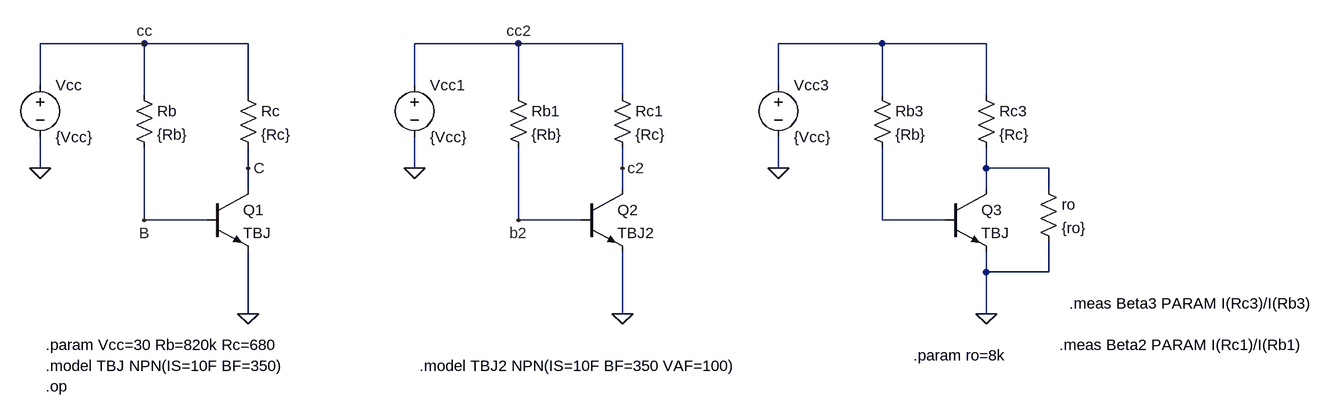
[diagram p0: schematic TBJ01Beta.asc]
TBJ01Beta.asc, the LTspice schematic file:
Version 4
SHEET 1 1960 928
WIRE 128 -16 -32 -16
WIRE 288 -16 128 -16
WIRE 704 -16 544 -16
WIRE 864 -16 704 -16
WIRE 1264 -16 1104 -16
WIRE 1424 -16 1264 -16
WIRE -32 48 -32 -16
WIRE 544 48 544 -16
WIRE 1104 48 1104 -16
WIRE 128 64 128 -16
WIRE 288 64 288 -16
WIRE 704 64 704 -16
WIRE 864 64 864 -16
WIRE 1264 64 1264 -16
WIRE 1424 64 1424 -16
WIRE -32 176 -32 128
WIRE 288 176 288 144
WIRE 544 176 544 128
WIRE 864 176 864 144
WIRE 1104 176 1104 128
WIRE 1424 176 1424 144
WIRE 1520 176 1424 176
WIRE 288 208 288 176
WIRE 864 208 864 176
WIRE 1424 208 1424 176
WIRE 1520 208 1520 176
WIRE 128 256 128 144
WIRE 224 256 128 256
WIRE 704 256 704 144
WIRE 800 256 704 256
WIRE 1264 256 1264 144
WIRE 1360 256 1264 256
WIRE 1424 336 1424 304
WIRE 1520 336 1520 288
WIRE 1520 336 1424 336
WIRE 288 400 288 304
WIRE 864 400 864 304
WIRE 1424 400 1424 336
FLAG -32 176 0
FLAG 288 400 0
FLAG 128 -16 cc
FLAG 128 256 B
FLAG 288 176 C
FLAG 544 176 0
FLAG 864 400 0
FLAG 704 -16 cc2
FLAG 704 256 b2
FLAG 864 176 c2
FLAG 1104 176 0
FLAG 1424 400 0
SYMBOL res 112 48 R0
SYMATTR InstName Rb
SYMATTR Value {Rb}
SYMBOL res 272 48 R0
SYMATTR InstName Rc
SYMATTR Value {Rc}
SYMBOL voltage -32 32 R0
WINDOW 123 0 0 Left 0
WINDOW 39 0 0 Left 0
SYMATTR InstName Vcc
SYMATTR Value {Vcc}
SYMBOL npn 224 208 R0
SYMATTR InstName Q1
SYMATTR Value TBJ
SYMBOL res 688 48 R0
SYMATTR InstName Rb1
SYMATTR Value {Rb}
SYMBOL res 848 48 R0
SYMATTR InstName Rc1
SYMATTR Value {Rc}
SYMBOL voltage 544 32 R0
WINDOW 123 0 0 Left 0
WINDOW 39 0 0 Left 0
SYMATTR InstName Vcc1
SYMATTR Value {Vcc}
SYMBOL npn 800 208 R0
SYMATTR InstName Q2
SYMATTR Value TBJ2
SYMBOL res 1248 48 R0
SYMATTR InstName Rb3
SYMATTR Value {Rb}
SYMBOL res 1408 48 R0
SYMATTR InstName Rc3
SYMATTR Value {Rc}
SYMBOL voltage 1104 32 R0
WINDOW 123 0 0 Left 0
WINDOW 39 0 0 Left 0
SYMATTR InstName Vcc3
SYMATTR Value {Vcc}
SYMBOL npn 1360 208 R0
SYMATTR InstName Q3
SYMATTR Value TBJ
SYMBOL res 1504 192 R0
SYMATTR InstName ro
SYMATTR Value {ro}
TEXT -24 448 Left 2 !.param Vcc=30 Rb=820k Rc=680
TEXT -24 512 Left 2 !.op
TEXT -24 480 Left 2 !.model TBJ NPN(IS=10F BF=350)
TEXT 552 480 Left 2 !.model TBJ2 NPN(IS=10F BF=350 VAF=100)
TEXT 1312 464 Left 2 !.param ro=8k
TEXT 1552 384 Left 2 !.meas Beta3 PARAM I(Rc3)/I(Rb3)
TEXT 1536 448 Left 2 !.meas Beta2 PARAM I(Rc1)/I(Rb1)

The netlist it stands for:
* TBJ01Beta.asc
Rb cc B {Rb}
Rc cc C {Rc}
Vcc cc 0 {Vcc}
Q1 C B 0 0 TBJ
Rb1 cc2 b2 {Rb}
Rc1 cc2 c2 {Rc}
Vcc1 cc2 0 {Vcc}
Q2 c2 b2 0 0 TBJ2
Rb3 N001 N003 {Rb}
Rc3 N001 N002 {Rc}
Vcc3 N001 0 {Vcc}
Q3 N002 N003 0 0 TBJ
ro N002 0 {ro}
.model NPN NPN
.model PNP PNP
.lib standard.bjt
.param Vcc=30 Rb=820k Rc=680
.op
.model TBJ NPN(IS=10F BF=350)
.model TBJ2 NPN(IS=10F BF=350 VAF=100)
.param ro=8k
.meas Beta3 PARAM I(Rc3)/I(Rb3)
.meas Beta2 PARAM I(Rc1)/I(Rb1)
.backanno
.end